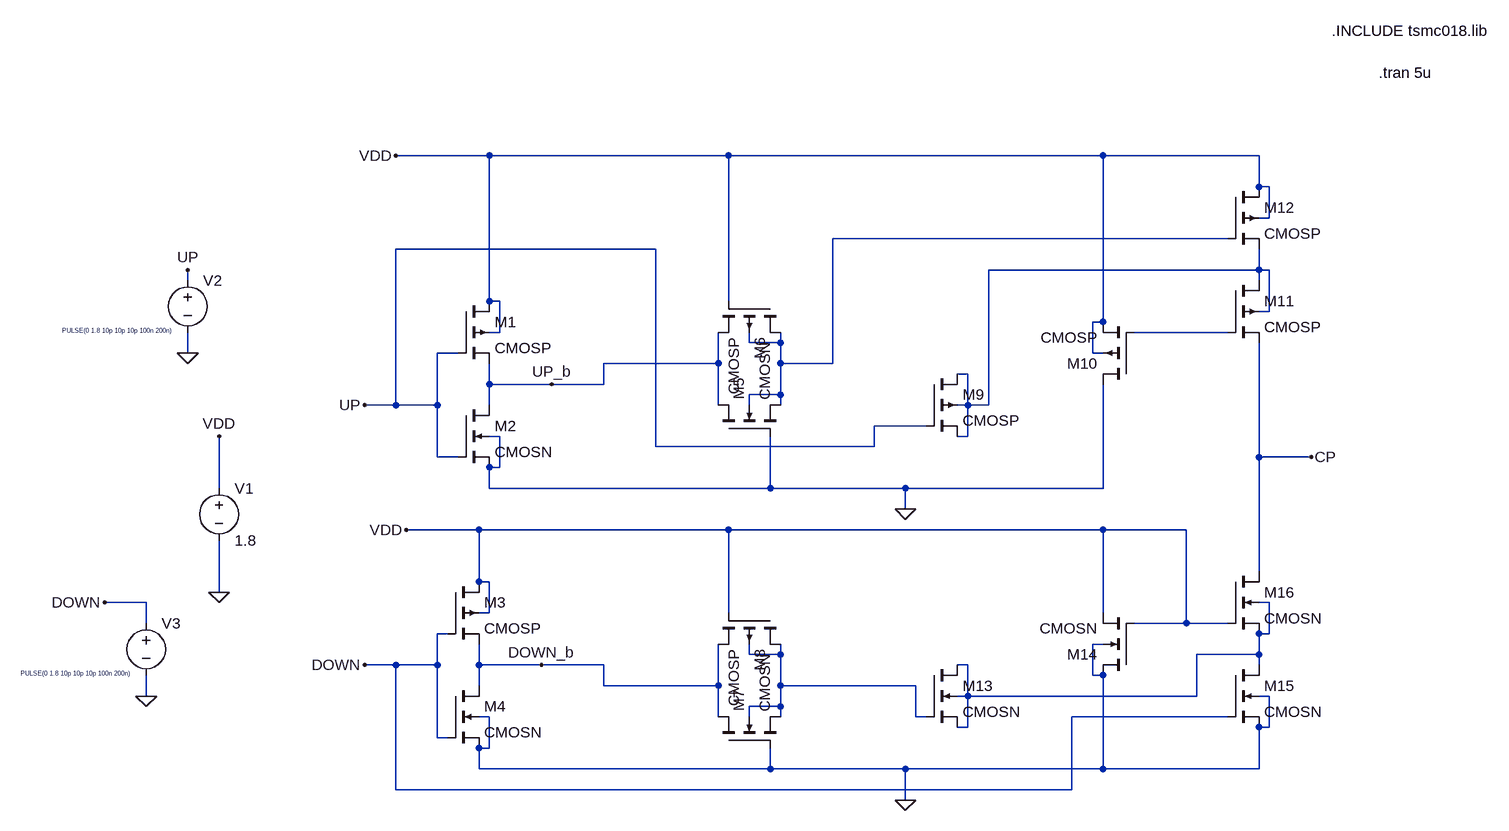
[diagram p0: schematic CP_test.asc]
CP_test.asc, the LTspice schematic file:
Version 4
SHEET 1 2212 772
WIRE 656 -304 512 -304
WIRE 1024 -304 656 -304
WIRE 1600 -304 1024 -304
WIRE 1840 -304 1600 -304
WIRE 1840 -256 1840 -304
WIRE 1856 -256 1840 -256
WIRE 1856 -208 1856 -256
WIRE 1856 -208 1840 -208
WIRE 1792 -176 1184 -176
WIRE 912 -160 512 -160
WIRE 1840 -128 1840 -160
WIRE 1840 -128 1424 -128
WIRE 1856 -128 1840 -128
WIRE 192 -112 192 -128
WIRE 1840 -112 1840 -128
WIRE 656 -80 656 -304
WIRE 672 -80 656 -80
WIRE 1024 -80 1024 -304
WIRE 1856 -64 1856 -128
WIRE 1856 -64 1840 -64
WIRE 1600 -48 1600 -304
WIRE 1600 -48 1584 -48
WIRE 672 -32 672 -80
WIRE 672 -32 656 -32
WIRE 1792 -32 1648 -32
WIRE 1056 -16 1056 -32
WIRE 1104 -16 1104 -32
WIRE 1104 -16 1056 -16
WIRE 192 0 192 -32
WIRE 608 0 576 0
WIRE 1584 0 1584 -48
WIRE 1600 0 1584 0
WIRE 1008 16 1008 -32
WIRE 1008 16 832 16
WIRE 1104 16 1104 -16
WIRE 1184 16 1184 -176
WIRE 1184 16 1104 16
WIRE 1392 32 1376 32
WIRE 656 48 656 16
WIRE 752 48 656 48
WIRE 832 48 832 16
WIRE 832 48 752 48
WIRE 1104 64 1104 16
WIRE 1104 64 1056 64
WIRE 512 80 512 -160
WIRE 512 80 464 80
WIRE 576 80 576 0
WIRE 576 80 512 80
WIRE 656 80 656 48
WIRE 1008 80 1008 16
WIRE 1056 80 1056 64
WIRE 1104 80 1104 64
WIRE 1392 80 1392 32
WIRE 1392 80 1376 80
WIRE 1424 80 1424 -128
WIRE 1424 80 1392 80
WIRE 1328 112 1248 112
WIRE 672 128 656 128
WIRE 1392 128 1392 80
WIRE 1392 128 1376 128
WIRE 912 144 912 -160
WIRE 1248 144 1248 112
WIRE 1248 144 912 144
WIRE 576 160 576 80
WIRE 608 160 576 160
WIRE 1840 160 1840 -16
WIRE 1920 160 1840 160
WIRE 672 176 672 128
WIRE 672 176 656 176
WIRE 240 208 240 128
WIRE 656 208 656 176
WIRE 1088 208 1088 128
WIRE 1088 208 656 208
WIRE 1296 208 1088 208
WIRE 1600 208 1600 48
WIRE 1600 208 1296 208
WIRE 1296 240 1296 208
WIRE 640 272 528 272
WIRE 1024 272 640 272
WIRE 1600 272 1024 272
WIRE 1728 272 1600 272
WIRE 1840 336 1840 160
WIRE 640 352 640 272
WIRE 656 352 640 352
WIRE 240 368 240 288
WIRE 128 384 64 384
WIRE 1856 384 1840 384
WIRE 656 400 656 352
WIRE 656 400 640 400
WIRE 1024 400 1024 272
WIRE 1600 400 1600 272
WIRE 128 416 128 384
WIRE 1728 416 1728 272
WIRE 1728 416 1648 416
WIRE 1792 416 1728 416
WIRE 592 432 576 432
WIRE 1856 432 1856 384
WIRE 1856 432 1840 432
WIRE 1600 448 1584 448
WIRE 1056 464 1056 448
WIRE 1104 464 1104 448
WIRE 1104 464 1056 464
WIRE 1840 464 1840 432
WIRE 1840 464 1744 464
WIRE 512 480 464 480
WIRE 576 480 576 432
WIRE 576 480 512 480
WIRE 640 480 640 448
WIRE 736 480 640 480
WIRE 832 480 736 480
WIRE 1392 480 1376 480
WIRE 1840 480 1840 464
WIRE 1584 496 1584 448
WIRE 1600 496 1584 496
WIRE 640 512 640 480
WIRE 832 512 832 480
WIRE 1008 512 1008 448
WIRE 1008 512 832 512
WIRE 1104 512 1104 464
WIRE 1312 512 1104 512
WIRE 128 528 128 496
WIRE 1392 528 1392 480
WIRE 1392 528 1376 528
WIRE 1744 528 1744 464
WIRE 1744 528 1392 528
WIRE 1856 528 1840 528
WIRE 1104 544 1104 512
WIRE 1104 544 1056 544
WIRE 656 560 640 560
WIRE 1008 560 1008 512
WIRE 1056 560 1056 544
WIRE 1104 560 1104 544
WIRE 1312 560 1312 512
WIRE 1328 560 1312 560
WIRE 1792 560 1552 560
WIRE 1392 576 1392 528
WIRE 1392 576 1376 576
WIRE 1856 576 1856 528
WIRE 1856 576 1840 576
WIRE 576 592 576 480
WIRE 592 592 576 592
WIRE 656 608 656 560
WIRE 656 608 640 608
WIRE 640 640 640 608
WIRE 1088 640 1088 608
WIRE 1088 640 640 640
WIRE 1296 640 1088 640
WIRE 1600 640 1600 496
WIRE 1600 640 1296 640
WIRE 1840 640 1840 576
WIRE 1840 640 1600 640
WIRE 512 672 512 480
WIRE 1552 672 1552 560
WIRE 1552 672 512 672
WIRE 1296 688 1296 640
FLAG 240 368 0
FLAG 1296 688 0
FLAG 1296 240 0
FLAG 240 128 VDD
FLAG 528 272 VDD
FLAG 512 -304 VDD
FLAG 1920 160 CP
FLAG 464 80 UP
FLAG 464 480 DOWN
FLAG 752 48 UP_b
FLAG 736 480 DOWN_b
FLAG 192 0 0
FLAG 192 -128 UP
FLAG 128 528 0
FLAG 64 384 DOWN
SYMBOL voltage 240 192 R0
WINDOW 123 0 0 Left 0
WINDOW 39 0 0 Left 0
SYMATTR InstName V1
SYMATTR Value 1.8
SYMBOL cmosp 608 -80 R0
SYMATTR InstName M1
SYMATTR Value2 l=180n w=540n
SYMBOL cmosn 608 80 R0
SYMATTR InstName M2
SYMATTR Value2 l=180n w=180n
SYMBOL cmosp 592 352 R0
SYMATTR InstName M3
SYMATTR Value2 l=180n w=540n
SYMBOL cmosn 592 512 R0
SYMATTR InstName M4
SYMATTR Value2 l=180n w=180n
SYMBOL cmosn 1008 128 R270
SYMATTR InstName M5
SYMATTR Value2 l=180n w=180n
SYMBOL cmosp 1104 -80 R90
SYMATTR InstName M6
SYMATTR Value2 l=180n w=540n
SYMBOL cmosn 1008 608 R270
SYMATTR InstName M7
SYMATTR Value2 l=180n w=180n
SYMBOL cmosp 1104 400 R90
SYMATTR InstName M8
SYMATTR Value2 l=180n w=540n
SYMBOL cmosp 1328 32 R0
SYMATTR InstName M9
SYMATTR Value2 l=180n w=540u
SYMBOL cmosp 1648 48 R180
SYMATTR InstName M10
SYMATTR Value2 l=180n w=540u
SYMBOL cmosp 1792 -112 R0
SYMATTR InstName M11
SYMATTR Value2 l=180n w=540n
SYMBOL cmosp 1792 -256 R0
SYMATTR InstName M12
SYMATTR Value2 l=180n w=45u
SYMBOL cmosn 1328 480 R0
SYMATTR InstName M13
SYMATTR Value2 l=180n w=180n
SYMBOL cmosn 1648 496 R180
SYMATTR InstName M14
SYMATTR Value2 l=180n w=180n
SYMBOL cmosn 1792 480 R0
SYMATTR InstName M15
SYMATTR Value2 l=180n w=15u
SYMBOL cmosn 1792 336 R0
SYMATTR InstName M16
SYMATTR Value2 l=180n w=180n
SYMBOL voltage 192 -128 R0
WINDOW 3 -193 93 Left 0
WINDOW 123 0 0 Left 0
WINDOW 39 0 0 Left 0
SYMATTR Value PULSE(0 1.8 10p 10p 10p 100n 200n)
SYMATTR InstName V2
SYMBOL voltage 128 400 R0
WINDOW 3 -193 93 Left 0
WINDOW 123 0 0 Left 0
WINDOW 39 0 0 Left 0
SYMATTR Value PULSE(0 1.8 10p 10p 10p 100n 200n)
SYMATTR InstName V3
TEXT 1952 -496 Left 2 !.INCLUDE tsmc018.lib
TEXT 2024 -432 Left 2 !.tran 5u

The netlist it stands for:
* CP_test.asc
V1 VDD 0 1.8
M1 VDD UP UP_b VDD CMOSP l=180n w=540n
M2 UP_b UP 0 0 CMOSN l=180n w=180n
M3 VDD DOWN DOWN_b VDD CMOSP l=180n w=540n
M4 DOWN_b DOWN 0 0 CMOSN l=180n w=180n
M5 UP_b 0 N001 N001 CMOSN l=180n w=180n
M6 N001 VDD UP_b N001 CMOSP l=180n w=540n
M7 DOWN_b 0 N005 N005 CMOSN l=180n w=180n
M8 N005 VDD DOWN_b N005 CMOSP l=180n w=540n
M9 N002 UP N002 N002 CMOSP l=180n w=540u
M10 0 N003 VDD VDD CMOSP l=180n w=540u
M11 N002 N003 CP N002 CMOSP l=180n w=540n
M12 VDD N001 N002 VDD CMOSP l=180n w=45u
M13 N004 N005 N004 N004 CMOSN l=180n w=180n
M14 0 VDD VDD 0 CMOSN l=180n w=180n
M15 N004 DOWN 0 0 CMOSN l=180n w=15u
M16 CP VDD N004 N004 CMOSN l=180n w=180n
V2 UP 0 PULSE(0 1.8 10p 10p 10p 100n 200n)
V3 DOWN 0 PULSE(0 1.8 10p 10p 10p 100n 200n)
.model NMOS NMOS
.model PMOS PMOS
.lib standard.mos
.INCLUDE tsmc018.lib
.tran 5u
.backanno
.end